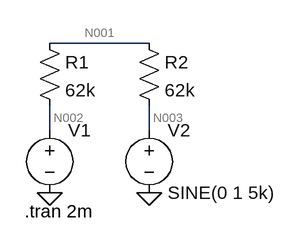
[diagram p0: schematic AC.asc]
AC.asc, the LTspice schematic file:
Version 4
SHEET 1 880 680
WIRE 224 32 96 32
WIRE 96 144 96 112
WIRE 224 144 224 112
FLAG 96 224 0
FLAG 224 224 0
SYMBOL voltage 96 128 R0
WINDOW 123 0 0 Left 2
WINDOW 39 0 0 Left 2
WINDOW 3 196 110 Invisible 2
SYMATTR InstName V1
SYMATTR Value PULSE(0 1 0 1ps 1ps 0.5m 1m)
SYMBOL voltage 224 128 R0
WINDOW 123 0 0 Left 2
WINDOW 39 0 0 Left 2
SYMATTR InstName V2
SYMATTR Value SINE(0 1 5k)
SYMBOL res 80 16 R0
SYMATTR InstName R1
SYMATTR Value 62k
SYMBOL res 208 16 R0
SYMATTR InstName R2
SYMATTR Value 62k
TEXT 64 248 Left 2 !.tran 2m

The netlist it stands for:
* AC.asc
V1 N002 0 PULSE(0 1 0 1ps 1ps 0.5m 1m)
V2 N003 0 SINE(0 1 5k)
R1 N001 N002 62k
R2 N001 N003 62k
.tran 2m
.backanno
.end

* Results of the author's LTspice run, read from the files saved beside the schematic
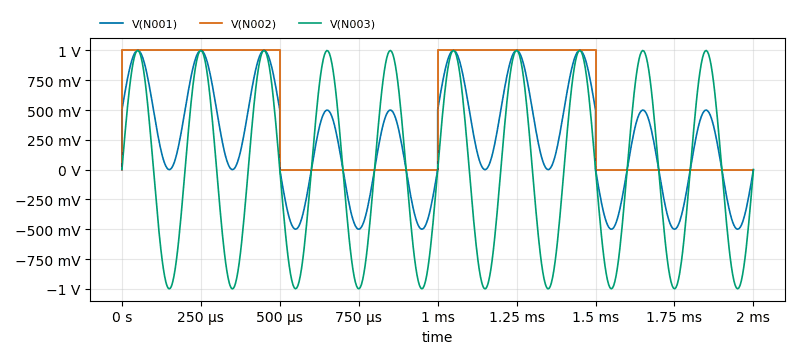
[diagram p1: Transient Analysis of AC.asc, plotted from the saved traces]
* Transient Analysis, 1 run:
*   V(N001): min -499.5 mV, max 999.5 mV, average 250 mV, rms 530.7 mV, last 0 V
*   V(N002): min 0 V, max 1 V, average 500 mV, rms 707.1 mV, last 0 V
*   V(N003): min -999.1 mV, max 999.1 mV, average 44.34 µV, rms 706.7 mV, last 0 V